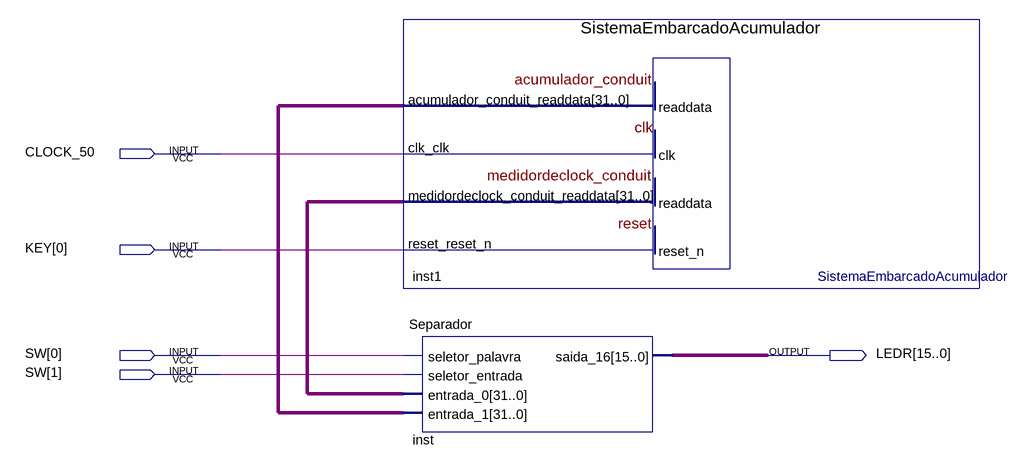
[diagram p0: schematic sheet]
// Quartus schematic AcumuladorNIOS.bdf as structural Verilog: 2 symbols, 5 pins
module AcumuladorNIOS (
  input  CLOCK_50,
  input  [0:0] KEY,
  input  [1:0] SW,
  output [15:0] LEDR
);

  wire [31:0] inst1_acumulador_conduit_readdata, inst1_medidordeclock_conduit_readdata;

  SistemaEmbarcadoAcumulador inst1 (
    .clk_clk(CLOCK_50), .reset_reset_n(KEY[0]),
    .acumulador_conduit_readdata(inst1_acumulador_conduit_readdata),
    .medidordeclock_conduit_readdata(inst1_medidordeclock_conduit_readdata));
  Separador inst (
    .seletor_palavra(SW[0]), .seletor_entrada(SW[1]), .entrada_0(inst1_medidordeclock_conduit_readdata),
    .entrada_1(inst1_acumulador_conduit_readdata), .saida_16(LEDR));
endmodule
